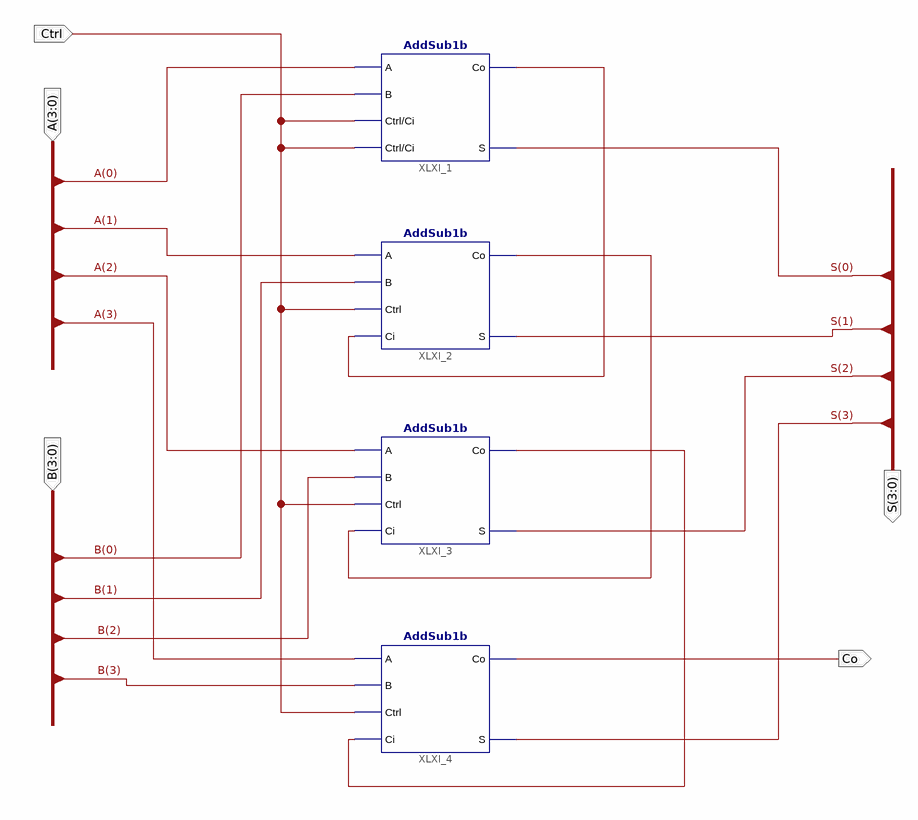
[diagram p0: schematic sheet 1]
// Xilinx ISE schematic AddSub4b.sch (kintex7) as structural Verilog: 4 symbols, 5 ports
module AddSub4b (
  input  Ctrl,
  input  [3:0] A,
  input  [3:0] B,
  output [3:0] S,
  output Co
);

  wire XLXN_18, XLXN_20, XLXN_22;

  AddSub1b XLXI_1 (.A(A[0]), .B(B[0]), .Ctrl(Ctrl), .Ci(Ctrl), .Co(XLXN_18), .S(S[0]));
  AddSub1b XLXI_2 (.A(A[1]), .B(B[1]), .Ctrl(Ctrl), .Ci(XLXN_18), .Co(XLXN_20), .S(S[1]));
  AddSub1b XLXI_3 (.A(A[2]), .B(B[2]), .Ctrl(Ctrl), .Ci(XLXN_20), .Co(XLXN_22), .S(S[2]));
  AddSub1b XLXI_4 (.A(A[3]), .B(B[3]), .Ctrl(Ctrl), .Ci(XLXN_22), .Co(Co), .S(S[3]));
endmodule
